# Altium schematic sheet SNC8600A.SchDoc: 1234
size A3; Author: SOUNDEC
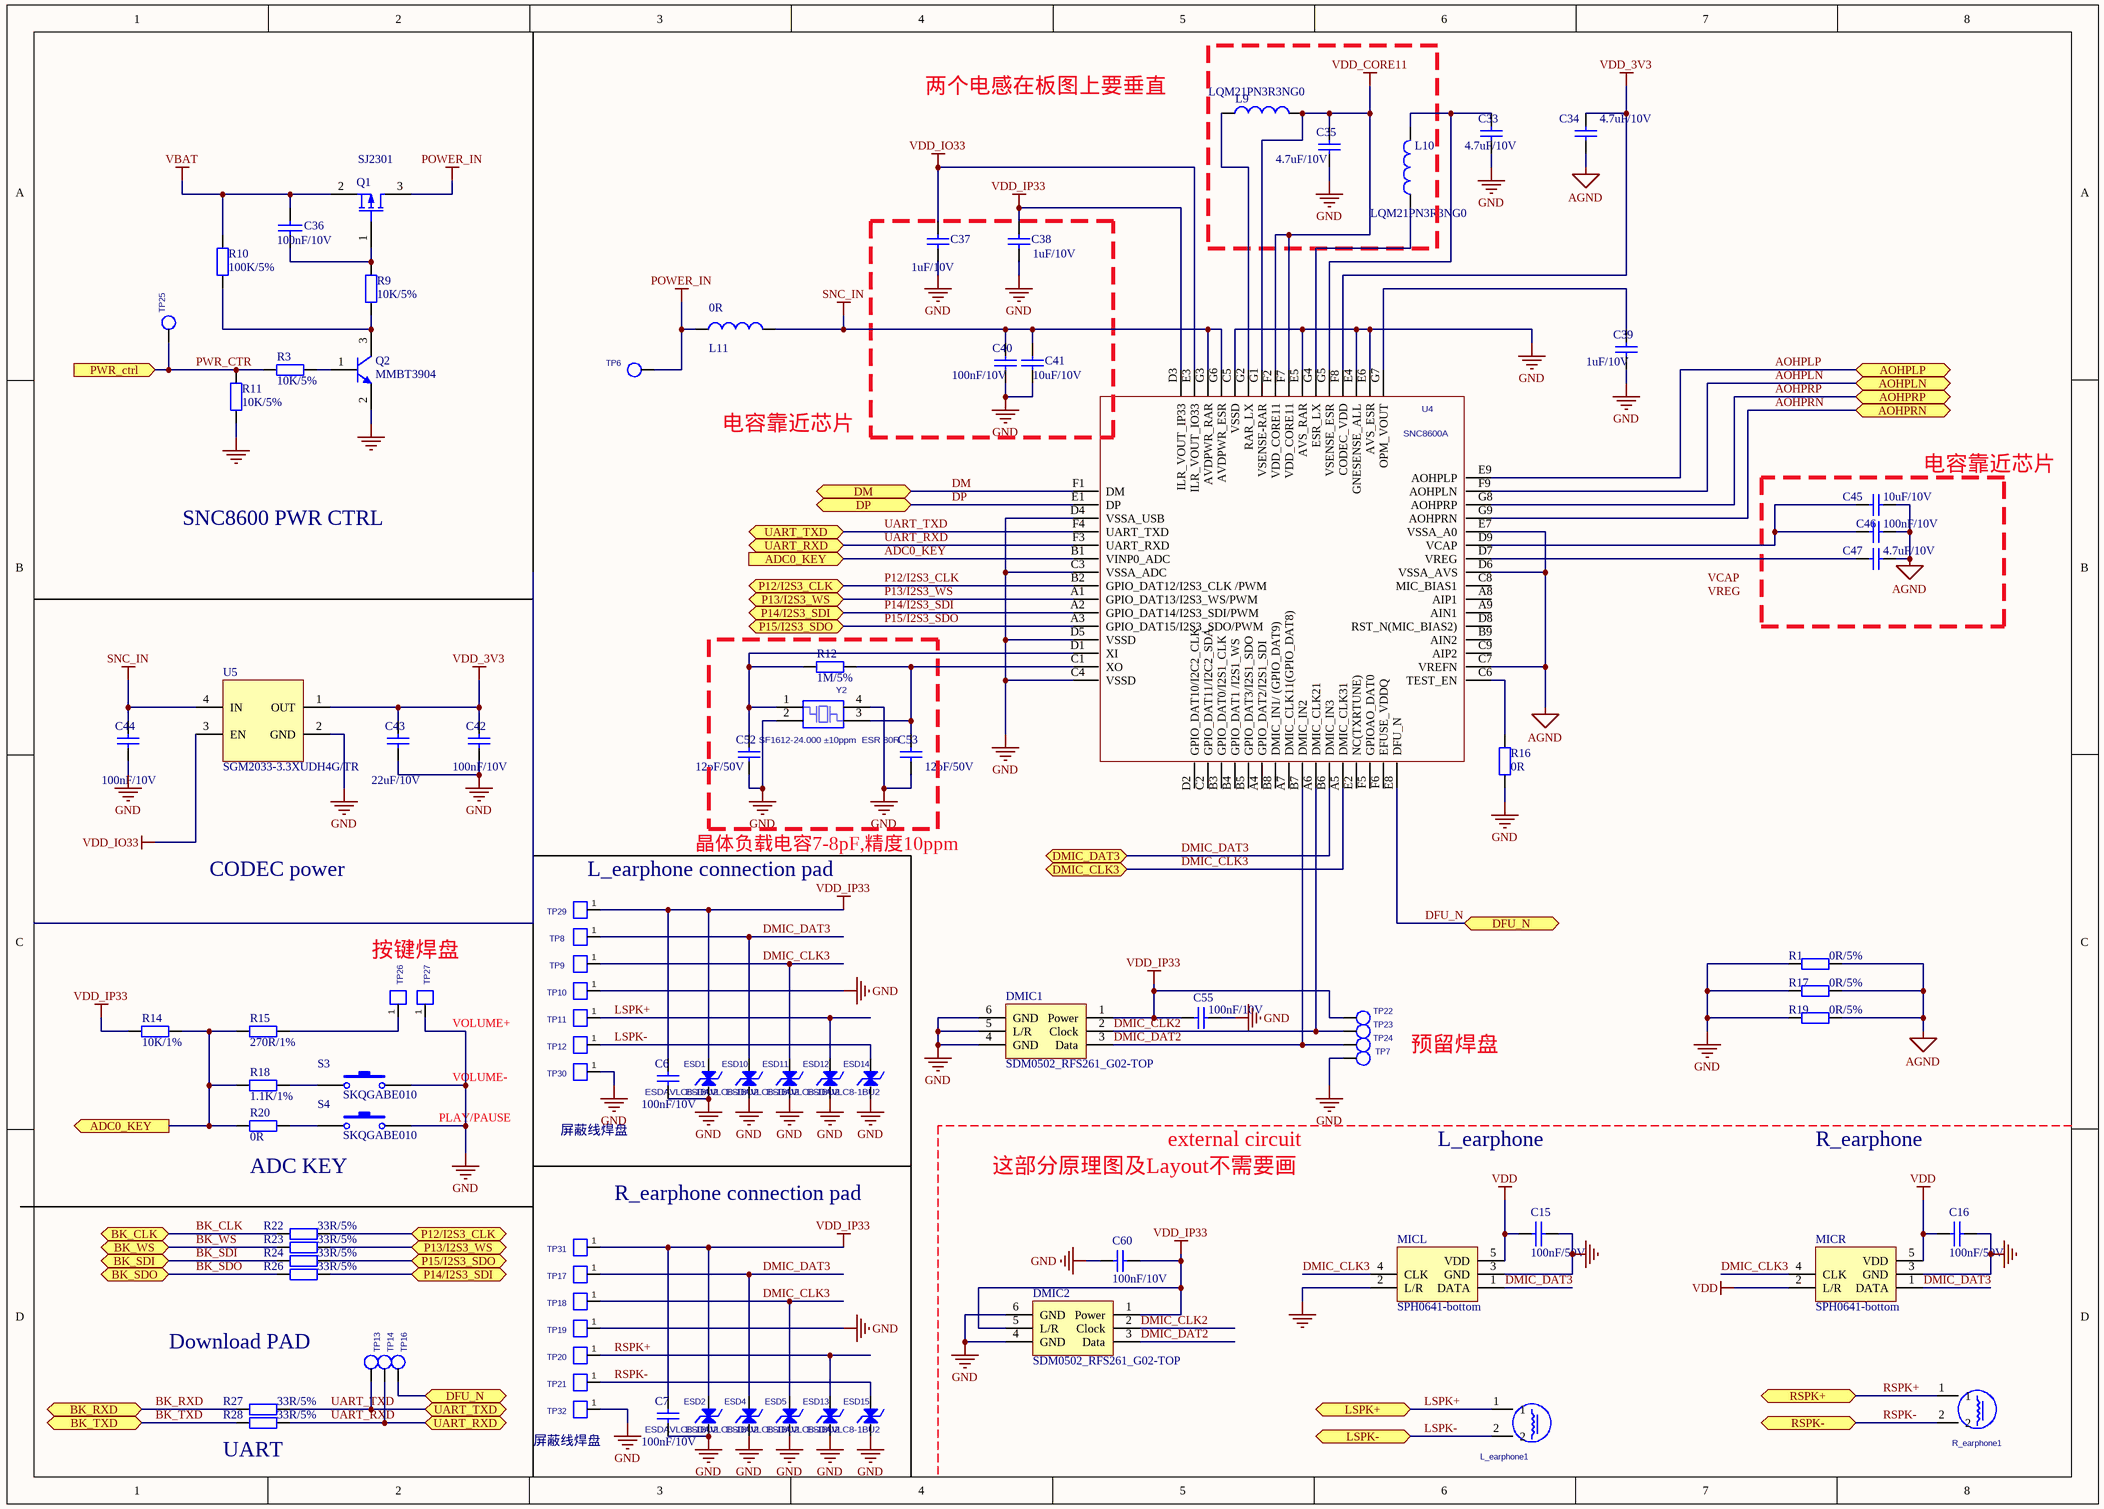
[diagram p0: SNC8600A.SchDoc]

## Parts
C6  100nF/10V  [0201]
C7  100nF/10V  [0201]
C15  100nF/50V  [0201]
C16  100nF/50V  [0201]
C33  4.7uF/10V  [C0402]
C34  4.7uF/10V  [C0402]
C35  4.7uF/10V  [C0402]
C36  100nF/10V  [0201]
C37  1uF/10V  [0201]
C38  1uF/10V  [0201]
C39  1uF/10V  [0201]
C40  100nF/10V  [0201]
C41  10uF/10V  [C0402]
C42  100nF/10V  [0201]
C43  22uF/10V  [C0402]
C44  100nF/10V  [0201]
C45  10uF/10V  [C0402]
C46  100nF/10V  [0201]
C47  4.7uF/10V  [C0402]
C52  12pF/50V  [0201]
C53  12pF/50V  [0201]
C55  100nF/10V  [0201]
C60  100nF/10V  [0201]
DMIC1  SDM0502_RFS261_G02-TOP  [3526_TOP]
DMIC2  SDM0502_RFS261_G02-TOP  [3526_TOP]
ESD1  ESDAVLC8-1BU2  [0201]
ESD2  ESDAVLC8-1BU2  [0201]
ESD4  ESDAVLC8-1BU2  [0201]
ESD5  ESDAVLC8-1BU2  [0201]
ESD10  ESDAVLC8-1BU2  [0201]
ESD11  ESDAVLC8-1BU2  [0201]
ESD12  ESDAVLC8-1BU2  [0201]
ESD13  ESDAVLC8-1BU2  [0201]
ESD14  ESDAVLC8-1BU2  [0201]
ESD15  ESDAVLC8-1BU2  [0201]
L9  LQM21PN3R3NG0  [L0805]
L10  LQM21PN3R3NG0  [L0805]
L11  0R  [0201]
L_earphone1  TS1  [2PIN-2.54]  (value not drawn)
MICL  SPH0641-bottom  [SPH_3526]
MICR  SPH0641-bottom  [SPH_3526]
Q1  SJ2301  [SOT23_3407]
Q2  MMBT3904  [SOT23]
R1  0R/5%  [0201]
R3  10K/5%  [0201]
R9  10K/5%  [0201]
R10  100K/5%  [0201]
R11  10K/5%  [0201]
R12  1M/5%  [0201]
R14  10K/1%  [0201]
R15  270R/1%  [0201]
R16  0R  [0201]
R17  0R/5%  [0201]
R18  1.1K/1%  [0201]
R19  0R/5%  [0201]
R20  0R  [0201]
R22  33R/5%  [0201]
R23  33R/5%  [0201]
R24  33R/5%  [0201]
R26  33R/5%  [0201]
R27  33R/5%  [0201]
R28  33R/5%  [0201]
R_earphone1  TS1  [2PIN-2.54]  (value not drawn)
S3  SKQGABE010  [TD-302060]
S4  SKQGABE010  [TD-302060]
TP6  TP1  [TP1-1MM]  (value not drawn)
TP7  TP1  [TP1-1MM]  (value not drawn)
TP8  TP  [TP1-1MM]  (value not drawn)
TP9  TP  [TP1-1MM]  (value not drawn)
TP10  TP  [TP1-1MM]  (value not drawn)
TP11  TP  [TP1-1MM]  (value not drawn)
TP12  TP  [TP1-1MM]  (value not drawn)
TP13  TP1  [TP1-1MM]  (value not drawn)
TP14  TP1  [TP1-1MM]  (value not drawn)
TP16  TP1  [TP1-1MM]  (value not drawn)
TP17  TP  [TP1-1MM]  (value not drawn)
TP18  TP  [TP1-1MM]  (value not drawn)
TP19  TP  [TP1-1MM]  (value not drawn)
TP20  TP  [TP1-1MM]  (value not drawn)
TP21  TP  [TP1-1MM]  (value not drawn)
TP22  TP1  [TP1-1MM]  (value not drawn)
TP23  TP1  [TP1-1MM]  (value not drawn)
TP24  TP1  [TP1-1MM]  (value not drawn)
TP25  TP1  [TP1-1MM]  (value not drawn)
TP26  TP  [TP1-1MM]  (value not drawn)
TP27  TP  [TP1-1MM]  (value not drawn)
TP29  TP  [TP1-1MM]  (value not drawn)
TP30  TP  [TP1-1MM]  (value not drawn)
TP31  TP  [TP1-1MM]  (value not drawn)
TP32  TP  [TP1-1MM]  (value not drawn)
U4  SNC8600A  [BGA63C50P9X7_500X350X100]
U5  SGM2033-3.3XUDH4G/TR  [UTDFN-1X1-4AL]
Y2  value SF1612-24.000 ±10ppm  ESR 80R  [SF1612]  (hidden comment: SF1612)

## Blocks framed on the sheet
电容靠近芯片: C45-C47

## Ports
ADC0_KEY (in), ADC0_KEY (out), AOHPLN, AOHPLP, AOHPRN, AOHPRP, BK_CLK, BK_RXD, BK_SDI, BK_SDO, BK_TXD, BK_WS, DFU_N, DM, DMIC_CLK3, DMIC_DAT3, DP, LSPK+, LSPK-, P12/I2S3_CLK, P13/I2S3_WS, P14/I2S3_SDI, P15/I2S3_SDO, PWR_ctrl (in), RSPK+, RSPK-, UART_RXD, UART_TXD

## Nets
AGND: C34.1 C45.1 C46.1 C47.1 R1.1 R17.1 R19.1 U4.C7(VREFN) U4.D6(VSSA_AVS) U4.E7(VSSA_A0)
GND: C6.1 C7.1 C15.1 C16.1 C33.1 C35.1 C37.1 C38.1 C39.1 C40.1 C41.1 C42.1 C43.1 C44.1 C52.1 C53.1 C55.1 C60.1 DMIC1.4(GND) DMIC1.5(L/R) DMIC1.6(GND) DMIC2.4(GND) DMIC2.6(GND) ESD1.2 ESD2.2 ESD4.2 ESD5.2 ESD10.2 ESD11.2 ESD12.2 ESD13.2 ESD14.2 ESD15.2 MICL.2(L/R) MICL.3(GND) MICR.3(GND) Q2.2(E) R1.2 R11.2 R16.2 R17.2 R19.2 S3.1 S4.1 TP7.1 TP10.1 TP19.1 TP27.1 TP30.1 TP32.1 U4.C3(VSSA_ADC) U4.C4(VSSD) U4.C5(VSSD) U4.D4(VSSA_USB) U4.D5(VSSD) U4.E4(GNESENSE_ALL) U4.E5(AVS_RAR) U4.E6(AVS_ESR) U5.2(GND) Y2.2 Y2.4
POWER_IN: L11.1 Q1.3(D) TP6.1
SNC_IN: C40.2 C41.2 C44.2 L11.2 U4.G3(AVDPWR_RAR) U4.G6(AVDPWR_ESR) U5.4(IN)
VBAT: C36.2 Q1.2(S) R10.1
VDD: C15.2 C16.2 MICL.5(VDD) MICR.2(L/R) MICR.5(VDD)
VDD_3V3: C34.2 C42.2 C43.2 U4.F8(CODEC_VDD) U5.1(OUT)
VDD_CORE11: C35.2 L9.2 U4.F2(VDD_CORE11) U4.F7(VDD_CORE11) U4.G1(VSENSE-RAR)
VDD_IO33: C37.2 U4.E3(ILR_VOUT_IO33) U5.3(EN)
VDD_IP33: C6.2 C7.2 C38.2 C55.2 C60.2 DMIC1.1(Power) DMIC2.1(Power) DMIC2.5(L/R) ESD1.1 ESD2.1 R14.2 TP22.1 TP29.1 TP31.1 U4.D3(ILR_VOUT_IP33)
ADC0_KEY: R14.1 R15.2 R18.2 R20.2 U4.B1(VINP0_ADC) ; port ADC0_KEY
AOHPLN: U4.F9(AOHPLN) ; port AOHPLN
AOHPLP: U4.E9(AOHPLP) ; port AOHPLP
AOHPRN: U4.G9(AOHPRN) ; port AOHPRN
AOHPRP: U4.G8(AOHPRP) ; port AOHPRP
BK_CLK: R22.2 ; port BK_CLK
BK_RXD: R27.2 ; port BK_RXD
BK_SDI: R24.2 ; port BK_SDI
BK_SDO: R26.2 ; port BK_SDO
BK_TXD: R28.2 ; port BK_TXD
BK_WS: R23.2 ; port BK_WS
DFU_N: TP16.1 U4.E8(DFU_N) ; port DFU_N
DM: U4.F1(DM) ; port DM
DMIC_CLK2: DMIC1.2(Clock) DMIC2.2(Clock) TP23.1 U4.A6(DMIC_CLK21)
DMIC_CLK3: ESD5.1 ESD11.1 MICL.4(CLK) MICR.4(CLK) TP9.1 TP18.1 U4.A5(DMIC_CLK31) ; port DMIC_CLK3
DMIC_DAT2: DMIC1.3(Data) DMIC2.3(Data) TP24.1 U4.B7(DMIC_IN2)
DMIC_DAT3: ESD4.1 ESD10.1 MICL.1(DATA) MICR.1(DATA) TP8.1 TP17.1 U4.B6(DMIC_IN3) ; port DMIC_DAT3
DP: U4.E1(DP) ; port DP
LSPK+: ESD12.1 L_earphone1.1 TP11.1 ; port LSPK+
LSPK-: ESD14.1 L_earphone1.2 TP12.1 ; port LSPK-
P12/I2S3_CLK: R22.1 U4.B2(GPIO_DAT12/I2S3_CLK_/PWM) ; port P12/I2S3_CLK
P13/I2S3_WS: R23.1 U4.A1(GPIO_DAT13/I2S3_WS/PWM) ; port P13/I2S3_WS
P14/I2S3_SDI: R26.1 U4.A2(GPIO_DAT14/I2S3_SDI/PWM) ; port P14/I2S3_SDI
P15/I2S3_SDO: R24.1 U4.A3(GPIO_DAT15/I2S3_SDO/PWM) ; port P15/I2S3_SDO
PWR_CTR: R3.1 R11.1 TP25.1 ; port PWR_ctrl
RSPK+: ESD13.1 R_earphone1.1 TP20.1 ; port RSPK+
RSPK-: ESD15.1 R_earphone1.2 TP21.1 ; port RSPK-
UART_RXD: R28.1 TP14.1 U4.F3(UART_RXD) ; port UART_RXD
UART_TXD: R27.1 TP13.1 U4.F4(UART_TXD) ; port UART_TXD
NetC33_2: C33.2 L10.2 U4.G5(VSENSE_ESR)
NetC36_1: C36.1 Q1.1(G) R9.1
NetC39_2: C39.2 U4.G7(OPM_VOUT)
NetC45_2: C45.2 C46.2 U4.D9(VCAP)
NetC47_2: C47.2 U4.D7(VREG)
NetC52_2: C52.2 R12.2 U4.D1(XI) Y2.1
NetC53_2: C53.2 R12.1 U4.C1(XO) Y2.3
NetL9_1: L9.1 U4.G2(RAR_LX)
NetL10_1: L10.1 U4.G4(ESR_LX)
NetQ2_1: Q2.1(B) R3.2
NetQ2_3: Q2.3(C) R9.2 R10.2
NetR15_1: R15.1 TP26.1
NetR16_1: R16.1 U4.C6(TEST_EN)
NetR18_1: R18.1 S3.2
NetR20_1: R20.1 S4.2

Not connected (* = marked no-connect by the designer): U4 A4(GPIO_DAT2/I2S1_SDI) A7(DMIC_CLK11(GPIO_DAT8)) A8(AIP1) A9(AIN1) B3(GPIO_DAT0/I2S1_CLK) B4(GPIO_DAT1_/I2S1_WS) B5(GPIO_DAT3/I2S1_SDO) B8(DMIC_IN1/_(GPIO_DAT9)) B9(AIN2) C2(GPIO_DAT11/I2C2_SDA) C8(MIC_BIAS1) C9(AIP2) D2(GPIO_DAT10/I2C2_CLK) D8(RST_N(MIC_BIAS2)) E2(NC(TXRTUNE)) F5(GPIOAO_DAT0) F6(EFUSE_VDDQ)

## Notes on the sheet
- 两个电感在板图上要垂直
- 电容靠近芯片
- SNC8600 PWR CTRL
- 晶体负载电容7-8pF,精度10ppm
- CODEC power
- (near TP29) L_earphone connection pad
- 按键焊盘
- (near TP27) VOLUME+
- 预留焊盘
- PLAY/PAUSE
- VOLUME-
- ADC KEY
- 屏蔽线焊盘
- 这部分原理图及Layout不需要画
- external circuit
- L_earphone
- R_earphone
- R_earphone connection pad
- Download PAD
- (near R28) UART
- (near TP32) 屏蔽线焊盘
- Labels drawn without touching a wire or pin: VCAP, VREG

## Library data of the parts
C6 C7 C33-C35 C37-C47 C52 C53 C55 C60 = Cap Semi: Capacitor (Semiconductor SIM Model); Value: 100pF; Published: 8-Jun-2000; LatestRevisionDate: 29-May-2009; LatestRevisionNote: IPC-7351 Footprint Added.; PackageReference: C1206; Publisher: Altium Limited; PackageDescription: Chip Capacitor
C15 C16 = CAP-0201: Capacitor
C36 = CAP: Capacitor; Comment_1: 30pF
DMIC1 DMIC2 = 3526-TOP
ESD1 ESD2 ESD4 ESD5 ESD10-ESD15 = ESD: Sim.Analog.Order: Model$; PCB DECAL: 0402
L9-L11 = Inductor: Code_IEC: 1005; Value: 10mH; Published: 8-Jun-2000; LatestRevisionDate: 29-May-2009; LatestRevisionNote: IPC-7351 Footprint Added.; PackageReference: 0402-A; Publisher: Altium Limited; PackageDescription: Chip Inductor; Code_JEITA: 0402
L_earphone1 R_earphone1 = TS1: Value: 1X2PIN-2.54MM-STRAIGHT(母座); PCB DECAL: 2PIN-2.54
MICL MICR = SPH0641: MEMS MICPHONE; Published: 8-Jun-2000; LatestRevisionDate: 29-May-2009; LatestRevisionNote: IPC-7351 Footprint Added.; PackageVersion: Mar-2002; PackageReference: SOT403-1; Publisher: Altium Limited; PackageDescription: 16-Pin Thin Small Outline Package 0.65 mm Pitch; Code_JEDEC: MO-153
Q1 = MOSFET-P: P-Channel MOSFET; Published: 8-Jun-2000; LatestRevisionDate: 17-Jul-2002; LatestRevisionNote: Re-released for DXP Platform.; PackageVersion: 1995/1996; PackageReference: E3; Publisher: Altium Limited; PackageDescription: TO, Flat Index; 3 In-Line, Axial Leads; Body Dia. 4.6mm; Lead Dia. 0.5 mm (max)
Q2 = 2N3904: NPN General Purpose Amplifier; Published: 8-Jun-2000; LatestRevisionDate: 15-Jan-2003; LatestRevisionNote: PCB Footprint 'BCY-W3/D4.7' replaced; DatasheetVersion: 1997; PackageVersion: Sep-1998; PackageReference: TO-92A; Publisher: Altium Limited; PackageDescription: TO, Flat Index; 3 In-Line, Axial Leads; Body Dia. 4.5mm; Leads 0.51 x 0.48 mm (max); ComponentLink1Description: Manufacturer Link; ComponentLink1URL: http://www.fairchildsemi.com/; ComponentLink2Description: Datasheet; ComponentLink2URL: http://www.fairchildsemi.com/ds/2N%2F2N3904.pdf
R1 R3 R9-R12 R17 R19 = Res2: Resistor; Value: 1M; Published: 8-Jun-2000; LatestRevisionDate: 17-Jul-2002; LatestRevisionNote: Re-released for DXP Platform.; PackageReference: AXIAL-0.4; Publisher: Altium Limited; PackageDescription: Axial Device, Thru-Hole; 2 Leads; 0.4 in Pin Spacing
R14-R16 R18 R20 R22-R24 R26-R28 = Res2: Resistor; Value: 1K; Published: 8-Jun-2000; LatestRevisionDate: 17-Jul-2002; LatestRevisionNote: Re-released for DXP Platform.; PackageReference: AXIAL-0.4; Publisher: Altium Limited; PackageDescription: Axial Device, Thru-Hole; 2 Leads; 0.4 in Pin Spacing
S3 S4 = SW-PB: Switch; Published: 24-Mar-1999; LatestRevisionDate: 17-Jul-2002; LatestRevisionNote: Re-released for DXP Platform.; PackageReference: SPST-2; Publisher: Altium Limited; PackageDescription: Switch; 2 Leads
TP8-TP12 TP17-TP21 TP26 TP27 TP29-TP32 = TP: PCB DECAL: RCT-0805-TP
U4 = SNC8600A: PCB DECAL: BGA0405-2; Value: BCHIP
U5 = SGM2033
TP6 TP7 TP13 TP14 TP16 TP22-TP25 = TP1: PCB DECAL: TP1
Y2 = SF1612: PCB DECAL: SF1612